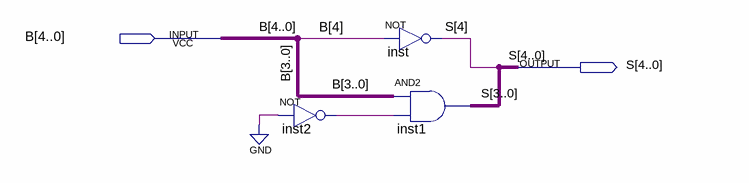
[diagram p0: schematic sheet]
// Quartus schematic negabit.bdf as structural Verilog: 3 symbols, 2 pins
module negabit (
  input  [4:0] B,
  output [4:0] S
);

  wire inst2_out;

  not inst2 (inst2_out, 1'b0);
  not inst (S[4], B[4]);
  assign S[3:0] = B[3:0] & {4{inst2_out}};  // AND2 inst1, 4 bits wide
endmodule
